# EAGLE design scary_rubber (EAGLE 9.6.2)
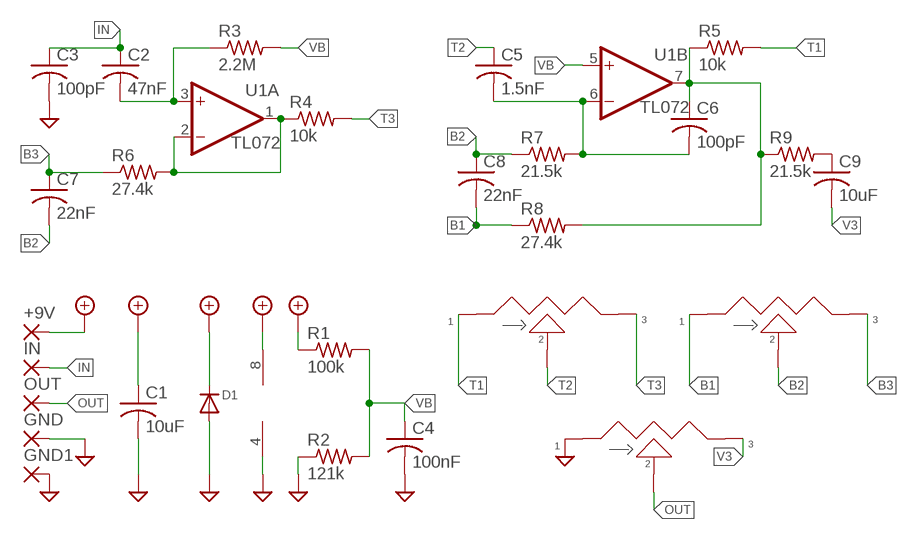
[diagram p0: schematic, sheet 1]

## Parts
+9V  SMD2  [SMD1,27-2,54]
BASS  B100k  POT_9MM_SMD  [POT_9MM_SMD]
C1  10uF  C-USC1206  [C1206]
C2  47nF  C-USC0603  [C0603]
C3  100pF  C-USC0603  [C0603]
C4  100nF  C-USC0603  [C0603]
C5  1.5nF  C-USC0603  [C0603]
C6  100pF  C-USC0603  [C0603]
C7  22nF  C-USC0603  [C0603]
C8  22nF  C-USC0603  [C0603]
C9  10uF  C-USC1206  [C1206]
D1  DIODESOD-123  [SOD-123]
GND  SMD2  [SMD1,27-2,54]
GND1  SMD2  [SMD1,27-2,54]
IN  SMD2  [SMD1,27-2,54]
OUT  SMD2  [SMD1,27-2,54]
R1  100k  R-US_R0603  [R0603]
R2  121k  R-US_R0603  [R0603]
R3  2.2M  R-US_R0603  [R0603]
R4  10k  R-US_R0603  [R0603]
R5  10k  R-US_R0603  [R0603]
R6  27.4k  R-US_R0603  [R0603]
R7  21.5k  R-US_R0603  [R0603]
R8  27.4k  R-US_R0603  [R0603]
R9  21.5k  R-US_R0603  [R0603]
TREB  B100k  POT_9MM_SMD  [POT_9MM_SMD]
U1  TL072  TL072TSSOP  [TSSOP-8]
VOLU  B100k  POT_9MM_SMD  [POT_9MM_SMD]

## Nets
+9V: +9V.1(P) C1.1 D1.C R1.1 U1.8(P:V+)
B1: BASS.1 C8.2 R8.1
B2: BASS.2 C7.2 C8.1 R7.1
B3: BASS.3 C7.1 R6.1
GND: C1.2 C3.2 C4.2 D1.A GND1.1(P) GND.1(P) R2.1 U1.4(P:V-) VOLU.1
IN: C2.1 C3.1 IN.1(P)
N$1: C2.2 R3.1 U1.3(A:+IN)
N$2: R4.1 R6.2 U1.1(A:OUT) U1.2(A:-IN)
N$3: C5.2 C6.2 R7.2 U1.6(B:-IN)
N$4: C6.1 R5.1 R8.2 R9.1 U1.7(B:OUT)
N$5: C9.1 R9.2
OUT: OUT.1(P) VOLU.2
T1: R5.2 TREB.1
T2: C5.1 TREB.2
T3: R4.2 TREB.3
V3: C9.2 VOLU.3
VB: C4.1 R1.2 R2.2 R3.2 U1.5(B:+IN)

## Library data of the parts
+9V GND GND1 IN OUT = wirepad:SMD2: SMD PAD
BASS TREB VOLU = Potentiometers_SMD:POT_9MM_SMD
C1-C9 = adafruit:C-US: CAPACITOR, American symbol
D1 = adafruit:DIODE: Diode SMADIODE - SMA Surface Mount Package 20V 1A Schottky Diode Digikey: 641-1014-6-ND DO-1N4148 - Through Hole Small Current Diode SOD-123 20V 1 A (.5mV Vf) Schottky Diode - Digikey: MBRX120TPMSCT-ND SOD-323 10V 570mA (.38mV Vf, 3ns) Schottky Diode - Digikey: ZLLS410CT-ND SOD-523 30V 30mA Schottky Diode (RB751S-40TE61) - Digikey: RB751S-40TE61CT-ND SOT23-R/W - SOT23 Package (R = Solder Paste/Reflow Ovens, W = Hand-Soldering) BAT54Film 40V 300mA - Digikey: 497-7162-1-ND
R1-R9 = adafruit:R-US_: RESISTOR, American symbol
U1 = MusicThingModular:TL072: Generic Dual Op Amp

## Board
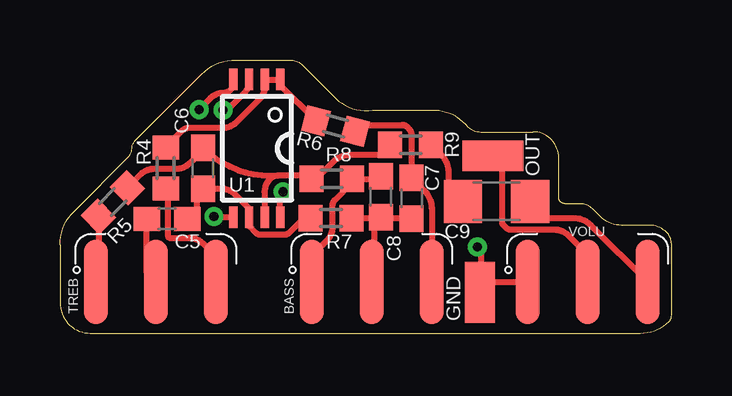
[diagram p1: board, top side]
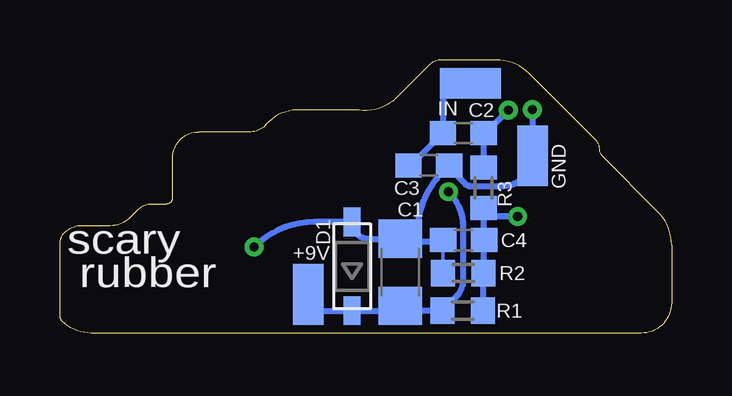
[diagram p2: board, bottom side, seen from below]

Size 25.5 x 11.4 mm. Coordinates in mm from the lower left corner, seen from the top.
Outline: 0,3.67 0,1.27 arc90 1.27,0 24.19,0 arc45 25.4,0.5 arc45 25.5,0.74 25.5,3.72 arc45 25.3,4.2 arc45 24.58,4.5 23.4,4.5 arc-45 22.55,4.85 22.21,5.19 arc45 21.7,5.4 21.05,5.4 arc-90 20.8,5.65 20.8,7.32 arc90 19.72,8.4 19.6,8.4 17.72,8.4 arc-45 17,8.6 arc45 15.79,9.3 13.03,9.3 arc-45 11.61,9.69 10.11,11.19 arc45 9.6,11.4 7.33,11.4 arc45 5.91,10.81 3.14,8.04 arc45 3,7.7 arc-45 2.86,7.36 0.59,5.09 arc45 0,3.67
Copper layers (1*16): Top 0.035mm / dielectric 1.5mm / Bottom 0.035mm
Design rules "default *": minimum track width 6mil, minimum drill 0.35mm, track to track 6mil, track to pad 6mil, pad to pad 6mil, via to via 6mil, smd to smd 6mil, copper to edge 12mil, drill to drill 6mil, minimum pad ring 10mil, minimum via ring 8mil, stop-mask expansion 4mil, vias tented up to drill 0mil, thermal gap 10mil

### Footprints (pad centres in the part's own frame; a part is rotated, then mirrored left to right if it is on the bottom)
SMD1,27-2,54 = smd 1.27 x 2.54: 1 0,0
POT_9MM_SMD = smd 0.991 x 3.505: 1 -2.5,0; 2 0,0; 3 2.5,0
C1206 = smd 1.6 x 1.8: 1 -1.4,0; 2 1.4,0
C0603 = smd 1.1 x 1: 1 -0.85,0; 2 0.85,0
SOD-123 = smd 1.2 x 0.7: A 1.85,0; C -1.85,0
R0603 = smd 1 x 1.1: 1 -0.85,0; 2 0.85,0
TSSOP-8 = smd 0.9 x 0.35: 1 -2.875,0.975; 2 -2.875,0.325; 3 -2.875,-0.325; 4 -2.875,-0.975; 5 2.875,-0.975; 6 2.875,-0.325; 7 2.875,0.325; 8 2.875,0.975

### Placement (x,y rotation side)
+9V  15.14,1.61 0 bottom
BASS  13,2.14 0 top
C1  11.31,2.54 90 bottom
C2  8.68,8.34 0 bottom
C3  10.12,6.99 0 bottom
C4  8.67,3.89 180 bottom
C5  4.47,4.76 0 top
C6  5.96,6.88 270 top
C7  14.66,5.63 270 top
C8  13.39,5.69 90 top
C9  18.2,5.5 0 top
D1  13.32,2.79 90 bottom
GND  17.51,1.71 0 top
GND1  5.8,7.4 0 bottom
IN  8.39,10.43 270 bottom
OUT  18.05,7.41 90 top
R1  8.71,0.94 0 bottom
R2  8.69,2.51 0 bottom
R3  7.84,6.07 270 bottom
R4  4.41,6.89 270 top
R5  2.21,5.47 225 top
R6  11.49,8.64 165 top
R7  11.3,4.8 180 top
R8  11.33,6.44 180 top
R9  14.62,7.86 0 top
TREB  4,2.14 0 top
U1  8.21,7.71 270 top
VOLU  22,2.14 0 top

### Tracks (layer width: path | path; a pad name or v marks a point on that pad's centre or on a via)
+9V  (via drill 0.38)
  Top 0.254: U1.8 9.19,5.79 v9.3,5.9
  Bottom 0.254: +9V.1 15.14,1.36 14.72,0.94 D1.C 11.51,0.94 11.32,1.12 | 11.32,1.12 C1.1 | 11.32,1.12 11.14,0.94 R1.1 8.99,1.51 arc-45 8.69,2.23 8.69,4.43 arc-45 v9.3,5.9
B1
  Top 0.254: BASS.1 10.5,3.24 11.15,3.89 arc45 11.37,4.43 11.37,5.36 arc-45 11.45,5.54 12.18,6.28 R8.1 13.29,6.44 C8.2
B2
  Top 0.254: C8.1 13.09,4.54 13.09,2.23 BASS.2 | R7.1 13.35,4.8 C8.1 | C7.2 13.45,4.78 C8.1
B3
  Top 0.254: BASS.3 15.5,5.22 arc45 15.2,5.94 C7.1 14.65,6.49 14.65,8.32 arc45 14.57,8.5 14.46,8.62 arc45 14.28,8.69 12.58,8.69 R6.1
GND  (via drill 0.38)
  Top 0.254: GND.1 17.55,1.75 | 17.55,1.75 17.94,2.14 VOLU.1 | v17.4,3.6 arc-45 17.55,3.24 17.55,1.75 | v5.8,9.33 6.28,9.81 arc-45 6.82,10.03 arc90 7.24,10.45 U1.4
  Bottom 0.152: R2.1 9.54,3.8 9.54,3.87 C4.2
  Bottom 0.254: 9.54,3.8 11,3.8 | 11,3.8 11.17,3.8 C1.2 12.62,3.94 arc90 D1.A 14.89,4.64 arc-45 v17.4,3.6 | v5.8,9.33 GND1.1 5.8,6.89 6.25,6.44 arc45 6.97,6.14 8.41,6.14 arc45 8.6,6.21 9.27,6.89 C3.2 9.57,6.69 arc-45 10.6,4.2 11,3.8
IN
  Bottom 0.254: IN.1 9.03,10.43 9.53,9.93 C2.1 10.88,6.99 C3.1
N$1  (via drill 0.38)
  Top 0.254: U1.3 7.88,10.53 arc-45 7.66,9.99 6.97,9.3 v6.8,9.3
  Bottom 0.254: v6.8,9.3 7.76,8.34 C2.2 R3.1
N$2
  Top 0.254: R6.2 9.19,10.34 U1.1 U1.2 8.54,10.3 arc-45 8.32,9.76 7.33,8.78 arc-45 6.8,8.56 5.35,8.56 arc45 5.1,8.45 4.41,7.77 R4.1
N$3
  Top 0.254: C5.2 5.7,5.14 5.7,5.77 C6.2 6.75,6.03 arc-45 7.28,5.81 7.89,5.2 U1.6 7.88,4.47 8.16,4.19 arc45 8.36,4.11 9.36,4.11 arc45 9.56,4.19 10.17,4.8 R7.2
N$4
  Top 0.254: U1.7 8.53,5.89 arc-45 8.75,6.43 arc-45 9.09,6.57 | R9.1 13.34,7.43 12.09,7.43 arc45 11.38,7.14 10.68,6.44 R8.2 10.35,6.57 9.09,6.57 | R5.1 3.38,6.64 arc-45 3.92,6.86 4.86,6.86 arc45 5.4,7.08 5.96,7.64 C6.1 arc45 8.75,6.57 9.09,6.57
N$5
  Top 0.254: R9.2 15.9,7.43 arc-45 16.2,6.71 16.2,6.1 C9.1
OUT
  Top 0.254: OUT.1 18.43,7.03 18.43,4.59 arc22 18.45,4.55 18.61,4.39 arc45 18.79,4.32 20.64,4.32 arc-45 21.18,4.09 22,3.27 VOLU.2
T1
  Top 0.254: R5.2 1.61,2.25 TREB.1
T2
  Top 0.254: TREB.2 3.62,2.52 C5.1
T3
  Top 0.254: R4.2 4.49,5.96 4.49,4.13 arc45 4.55,3.98 5.4,3.98 arc-45 5.94,3.76 6.5,3.2 TREB.3
V3
  Top 0.254: C9.2 20.3,4.8 21.42,4.8 arc-45 22.14,4.5 VOLU.3
VB  (via drill 0.38)
  Top 0.254: U1.5 6.42,4.83 v6.42,4.87
  Bottom 0.254: R1.2 7.84,0.96 R2.2 7.82,2.53 C4.1 7.82,4.9 | 7.82,4.9 7.82,5.2 R3.2 | v6.42,4.87 7.79,4.87 7.82,4.9

### Text on the board
bPlace: GND | scary | rubber